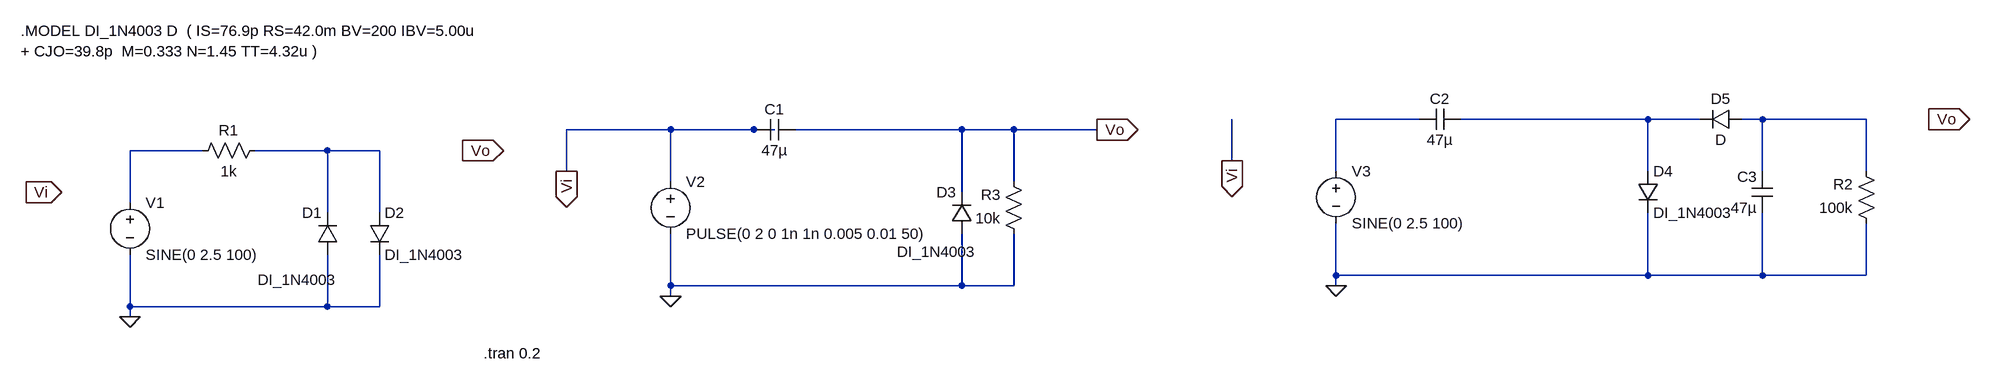
[diagram p0: schematic Simu_B.asc]
Simu_B.asc, the LTspice schematic file:
Version 4.1
SHEET 1 2936 680
WIRE 2064 -32 1936 -32
WIRE 2416 -32 2128 -32
WIRE 2496 -32 2416 -32
WIRE 2592 -32 2560 -32
WIRE 2752 -32 2592 -32
WIRE 912 -16 752 -16
WIRE 1040 -16 912 -16
WIRE 1072 -16 1040 -16
WIRE 1360 -16 1104 -16
WIRE 1440 -16 1360 -16
WIRE 1568 -16 1440 -16
WIRE 192 16 80 16
WIRE 384 16 272 16
WIRE 464 16 384 16
WIRE 1776 32 1776 -32
WIRE 752 48 752 -16
WIRE 1936 48 1936 -32
WIRE 2416 48 2416 -32
WIRE 2592 48 2592 -32
WIRE 2752 48 2752 -32
WIRE 912 64 912 -16
WIRE 1440 64 1440 -16
WIRE 1360 80 1360 -16
WIRE 80 96 80 16
WIRE 384 112 384 16
WIRE 464 112 464 16
WIRE 1936 208 1936 128
WIRE 2416 208 2416 112
WIRE 2416 208 1936 208
WIRE 2592 208 2592 112
WIRE 2592 208 2416 208
WIRE 2752 208 2752 128
WIRE 2752 208 2592 208
WIRE 912 224 912 144
WIRE 1360 224 1360 144
WIRE 1360 224 912 224
WIRE 1440 224 1440 144
WIRE 1440 224 1360 224
WIRE 1936 224 1936 208
WIRE 912 240 912 224
WIRE 80 256 80 176
WIRE 384 256 384 176
WIRE 384 256 80 256
WIRE 464 256 464 176
WIRE 464 256 384 256
WIRE 80 272 80 256
FLAG 80 272 0
FLAG -80 80 Vi
IOPIN -80 80 Out
FLAG 592 16 Vo
IOPIN 592 16 Out
FLAG 912 240 0
FLAG 752 48 Vi
IOPIN 752 48 Out
FLAG 1568 -16 Vo
IOPIN 1568 -16 Out
FLAG 1936 224 0
FLAG 1776 32 Vi
IOPIN 1776 32 Out
FLAG 2848 -32 Vo
IOPIN 2848 -32 Out
SYMBOL res 288 0 R90
WINDOW 0 0 56 VBottom 2
WINDOW 3 32 56 VTop 2
SYMATTR InstName R1
SYMATTR Value 1k
SYMBOL diode 400 176 R180
WINDOW 0 24 64 Left 2
WINDOW 3 1 -39 Left 2
SYMATTR InstName D1
SYMATTR Value DI_1N4003
SYMBOL diode 448 112 R0
SYMATTR InstName D2
SYMATTR Value DI_1N4003
SYMBOL voltage 80 80 R0
WINDOW 123 0 0 Left 0
WINDOW 39 0 0 Left 0
SYMATTR InstName V1
SYMATTR Value SINE(0 2.5 100)
SYMBOL diode 1376 144 R180
WINDOW 0 24 64 Left 2
WINDOW 3 -7 -28 Left 2
SYMATTR InstName D3
SYMATTR Value DI_1N4003
SYMBOL voltage 912 48 R0
WINDOW 123 0 0 Left 0
WINDOW 39 0 0 Left 0
SYMATTR InstName V2
SYMATTR Value PULSE(0 2 0 1n 1n 0.005 0.01 50)
SYMBOL res 1456 160 R180
WINDOW 0 36 76 Left 2
WINDOW 3 36 40 Left 2
SYMATTR InstName R3
SYMATTR Value 10k
SYMBOL cap 1104 -32 R90
WINDOW 0 0 32 VBottom 2
WINDOW 3 32 32 VTop 2
SYMATTR InstName C1
SYMATTR Value 47µ
SYMBOL diode 2400 48 R0
SYMATTR InstName D4
SYMATTR Value DI_1N4003
SYMBOL res 2768 144 R180
WINDOW 0 36 76 Left 2
WINDOW 3 36 40 Left 2
SYMATTR InstName R2
SYMATTR Value 100k
SYMBOL cap 2128 -48 R90
WINDOW 0 0 32 VBottom 2
WINDOW 3 32 32 VTop 2
SYMATTR InstName C2
SYMATTR Value 47µ
SYMBOL cap 2608 112 R180
WINDOW 0 24 56 Left 2
WINDOW 3 24 8 Left 2
SYMATTR InstName C3
SYMATTR Value 47µ
SYMBOL diode 2560 -48 R90
WINDOW 0 0 32 VBottom 2
WINDOW 3 32 32 VTop 2
SYMATTR InstName D5
SYMBOL voltage 1936 32 R0
WINDOW 123 0 0 Left 0
WINDOW 39 0 0 Left 0
SYMATTR InstName V3
SYMATTR Value SINE(0 2.5 100)
TEXT -88 -168 Left 2 !.MODEL DI_1N4003 D  ( IS=76.9p RS=42.0m BV=200 IBV=5.00u\n+ CJO=39.8p  M=0.333 N=1.45 TT=4.32u )
TEXT 624 328 Left 2 !.tran 0.2

The netlist it stands for:
* Simu_B.asc
R1 N005 N004 1k
D1 0 N005 DI_1N4003
D2 N005 0 DI_1N4003
V1 N004 0 SINE(0 2.5 100)
D3 0 Vo DI_1N4003
V2 Vi 0 PULSE(0 2 0 1n 1n 0.005 0.01 50)
R3 0 Vo 10k
C1 Vo Vi 47µ
D4 N002 0 DI_1N4003
R2 0 N003 100k
C2 N002 N001 47µ
C3 0 N003 47µ
D5 N003 N002 D
V3 N001 0 SINE(0 2.5 100)
.model D D
.lib standard.dio
.MODEL DI_1N4003 D  ( IS=76.9p RS=42.0m BV=200 IBV=5.00u
+ CJO=39.8p  M=0.333 N=1.45 TT=4.32u )
.tran 0.2
.backanno
.end

* Results of the author's LTspice run, read from the files saved beside the schematic
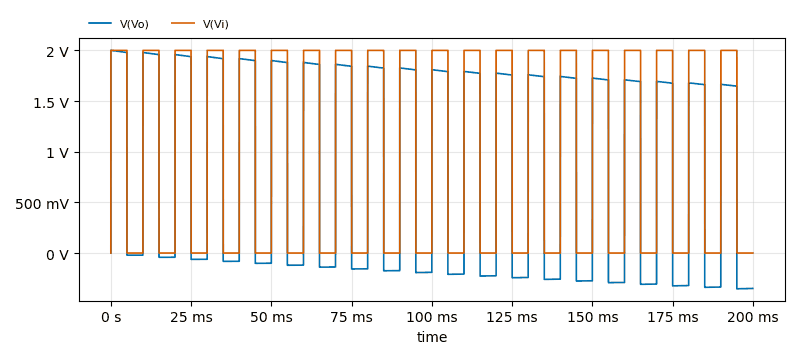
[diagram p1: Transient Analysis of Simu_B.asc, plotted from the saved traces]
* Transient Analysis, 1 run:
*   V(Vo): min -352.9 mV, max 2 V, average 809 mV, rms 1.294 V, last -349.4 mV
*   V(Vi): min 0 V, max 2 V, average 1 V, rms 1.414 V, last 0 V